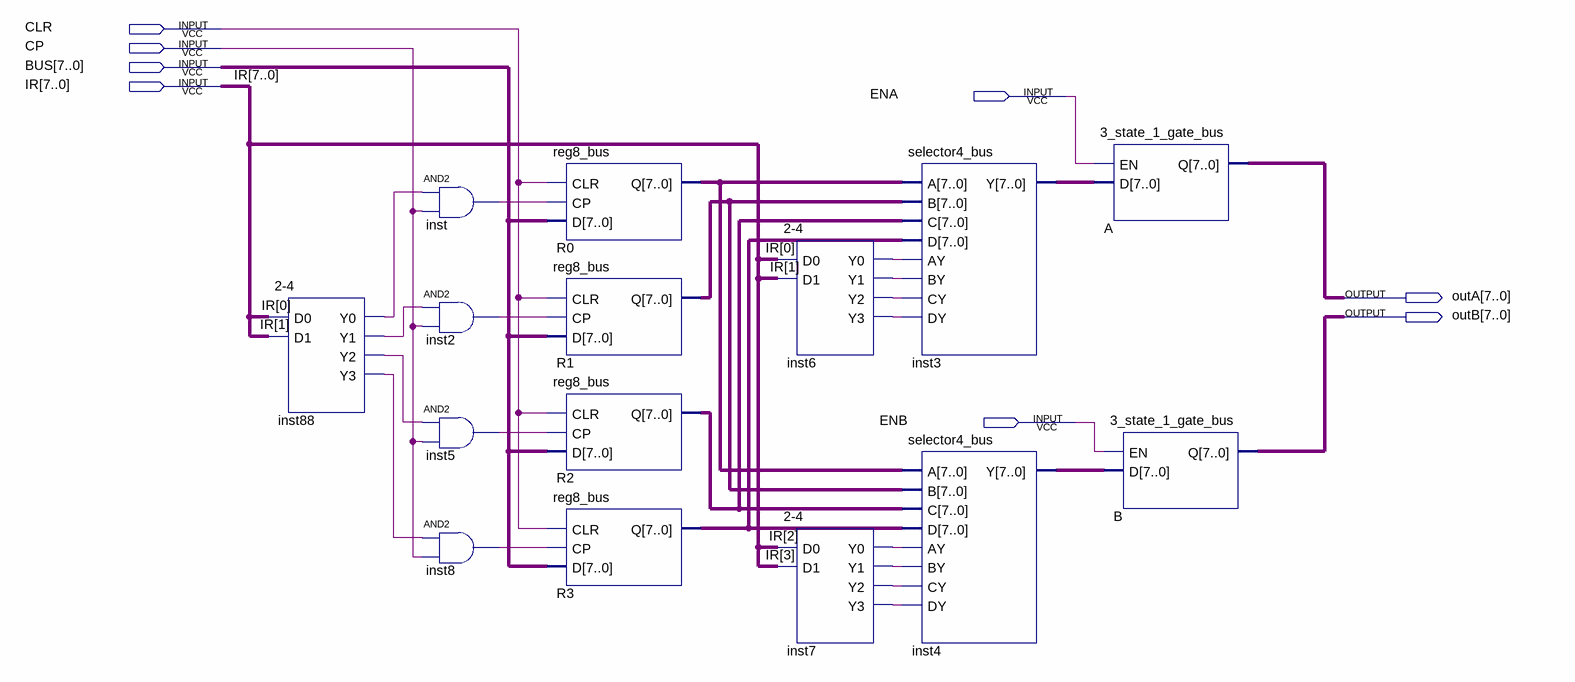
[diagram p0: schematic sheet]
// Quartus schematic reg_group_bus.bdf as structural Verilog: 15 symbols, 8 pins
module reg_group_bus (
  input  CLR,
  input  CP,
  input  [7:0] BUS,
  input  [7:0] IR,
  input  ENA,
  input  ENB,
  output [7:0] outA,
  output [7:0] outB
);

  wire inst2_out, inst5_out, inst6_y0, inst6_y1, inst6_y2, inst6_y3, inst7_y0, inst7_y1, inst7_y2, inst7_y3,
       inst8_out, inst88_y0, inst88_y1, inst88_y2, inst88_y3, inst_out;
  wire [7:0] inst3_y, inst4_y, R0_q, R1_q, R2_q, R3_q;

  \2-4  inst88 (.D0(IR[0]), .D1(IR[1]), .Y0(inst88_y0), .Y1(inst88_y1), .Y2(inst88_y2), .Y3(inst88_y3));
  and inst (inst_out, inst88_y0, CP);
  and inst2 (inst2_out, inst88_y1, CP);
  and inst5 (inst5_out, inst88_y2, CP);
  and inst8 (inst8_out, inst88_y3, CP);
  reg8_bus R0 (.CLR(CLR), .CP(inst_out), .D(BUS), .Q(R0_q));
  reg8_bus R1 (.CLR(CLR), .CP(inst2_out), .D(BUS), .Q(R1_q));
  reg8_bus R2 (.CLR(CLR), .CP(inst5_out), .D(BUS), .Q(R2_q));
  reg8_bus R3 (.CLR(CLR), .CP(inst8_out), .D(BUS), .Q(R3_q));
  \2-4  inst6 (.D0(IR[0]), .D1(IR[1]), .Y0(inst6_y0), .Y1(inst6_y1), .Y2(inst6_y2), .Y3(inst6_y3));
  \2-4  inst7 (.D0(IR[2]), .D1(IR[3]), .Y0(inst7_y0), .Y1(inst7_y1), .Y2(inst7_y2), .Y3(inst7_y3));
  selector4_bus inst3 (
    .A(R0_q), .B(R1_q), .C(R2_q), .D(R3_q), .AY(inst6_y0), .BY(inst6_y1), .CY(inst6_y2), .DY(inst6_y3),
    .Y(inst3_y));
  selector4_bus inst4 (
    .A(R0_q), .B(R1_q), .C(R2_q), .D(R3_q), .AY(inst7_y0), .BY(inst7_y1), .CY(inst7_y2), .DY(inst7_y3),
    .Y(inst4_y));
  \3_state_1_gate_bus  A (.EN(ENA), .D(inst3_y), .Q(outA));
  \3_state_1_gate_bus  B (.EN(ENB), .D(inst4_y), .Q(outB));
endmodule
